# Altium schematic sheet PALM_CONNECTOR.SchDoc
size Letter; SheetNumber: 2; SheetTotal: 15
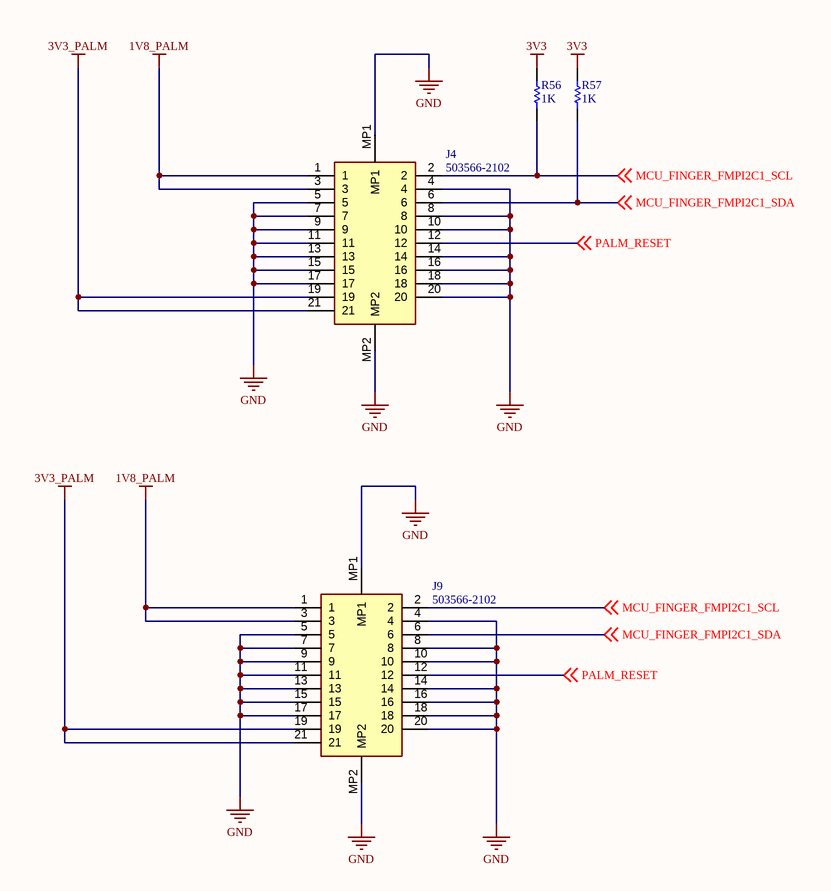
[diagram p0: PALM_CONNECTOR.SchDoc]

## Parts
J4  503566-2102  [5035662102]
J9  503566-2102  [5035662102]
R56  1K  [RESC1005X40X25LL05T10]
R57  1K  [RESC1005X40X25LL05T10]

## Nets
1V8_PALM: J4.1 J4.3 J9.1 J9.3
3V3: R56.2 R57.2
3V3_PALM: J4.19 J4.21 J9.19 J9.21
GND: J4.4 J4.5 J4.7 J4.8 J4.9 J4.10 J4.11 J4.13 J4.14 J4.15 J4.16 J4.17 J4.18 J4.20 J4.MP1 J4.MP2 J9.4 J9.5 J9.7 J9.8 J9.9 J9.10 J9.11 J9.13 J9.14 J9.15 J9.16 J9.17 J9.18 J9.20 J9.MP1 J9.MP2
MCU_FINGER_FMPI2C1_SCL: J4.2 J9.2 R56.1 ; off-sheet MCU_FINGER_FMPI2C1_SCL
MCU_FINGER_FMPI2C1_SDA: J4.6 J9.6 R57.1 ; off-sheet MCU_FINGER_FMPI2C1_SDA
PALM_RESET: J4.12 J9.12 ; off-sheet PALM_RESET

## Notes on the sheet
- Title
- Copyright (c) Meta Platforms, Inc. and affiliates.
  All rights reserved.
  This source code is licensed under the license found in the
  LICENSE file in the root directory of this source tree.
- Sheet
- of

## Library data of the parts
J4 J9 = 503566-2102: Connector; Manufacturer_Name: Molex; Datasheet Link: https://www.molex.com/pdm_docs/sd/5035662102_sd.pdf; Height: 1.69mm; Manufacturer_Part_Number: 503566-2102; Mouser Part Number: 538-503566-2102; Mouser Price/Stock: https://www.mouser.co.uk/ProductDetail/Molex/503566-2102?qs=0lSvoLzn4L8%252Bw2FHrppS3g%3D%3D
R56 R57 = CMP-2002-07941-1: Part Number: RC0402JR-071KL; Manufacturer: Yageo / Phycomp